# Altium schematic sheet P19_M.2 Key M SSD_Wi-Fi_BT.SchDoc
size 420 x 297 mm
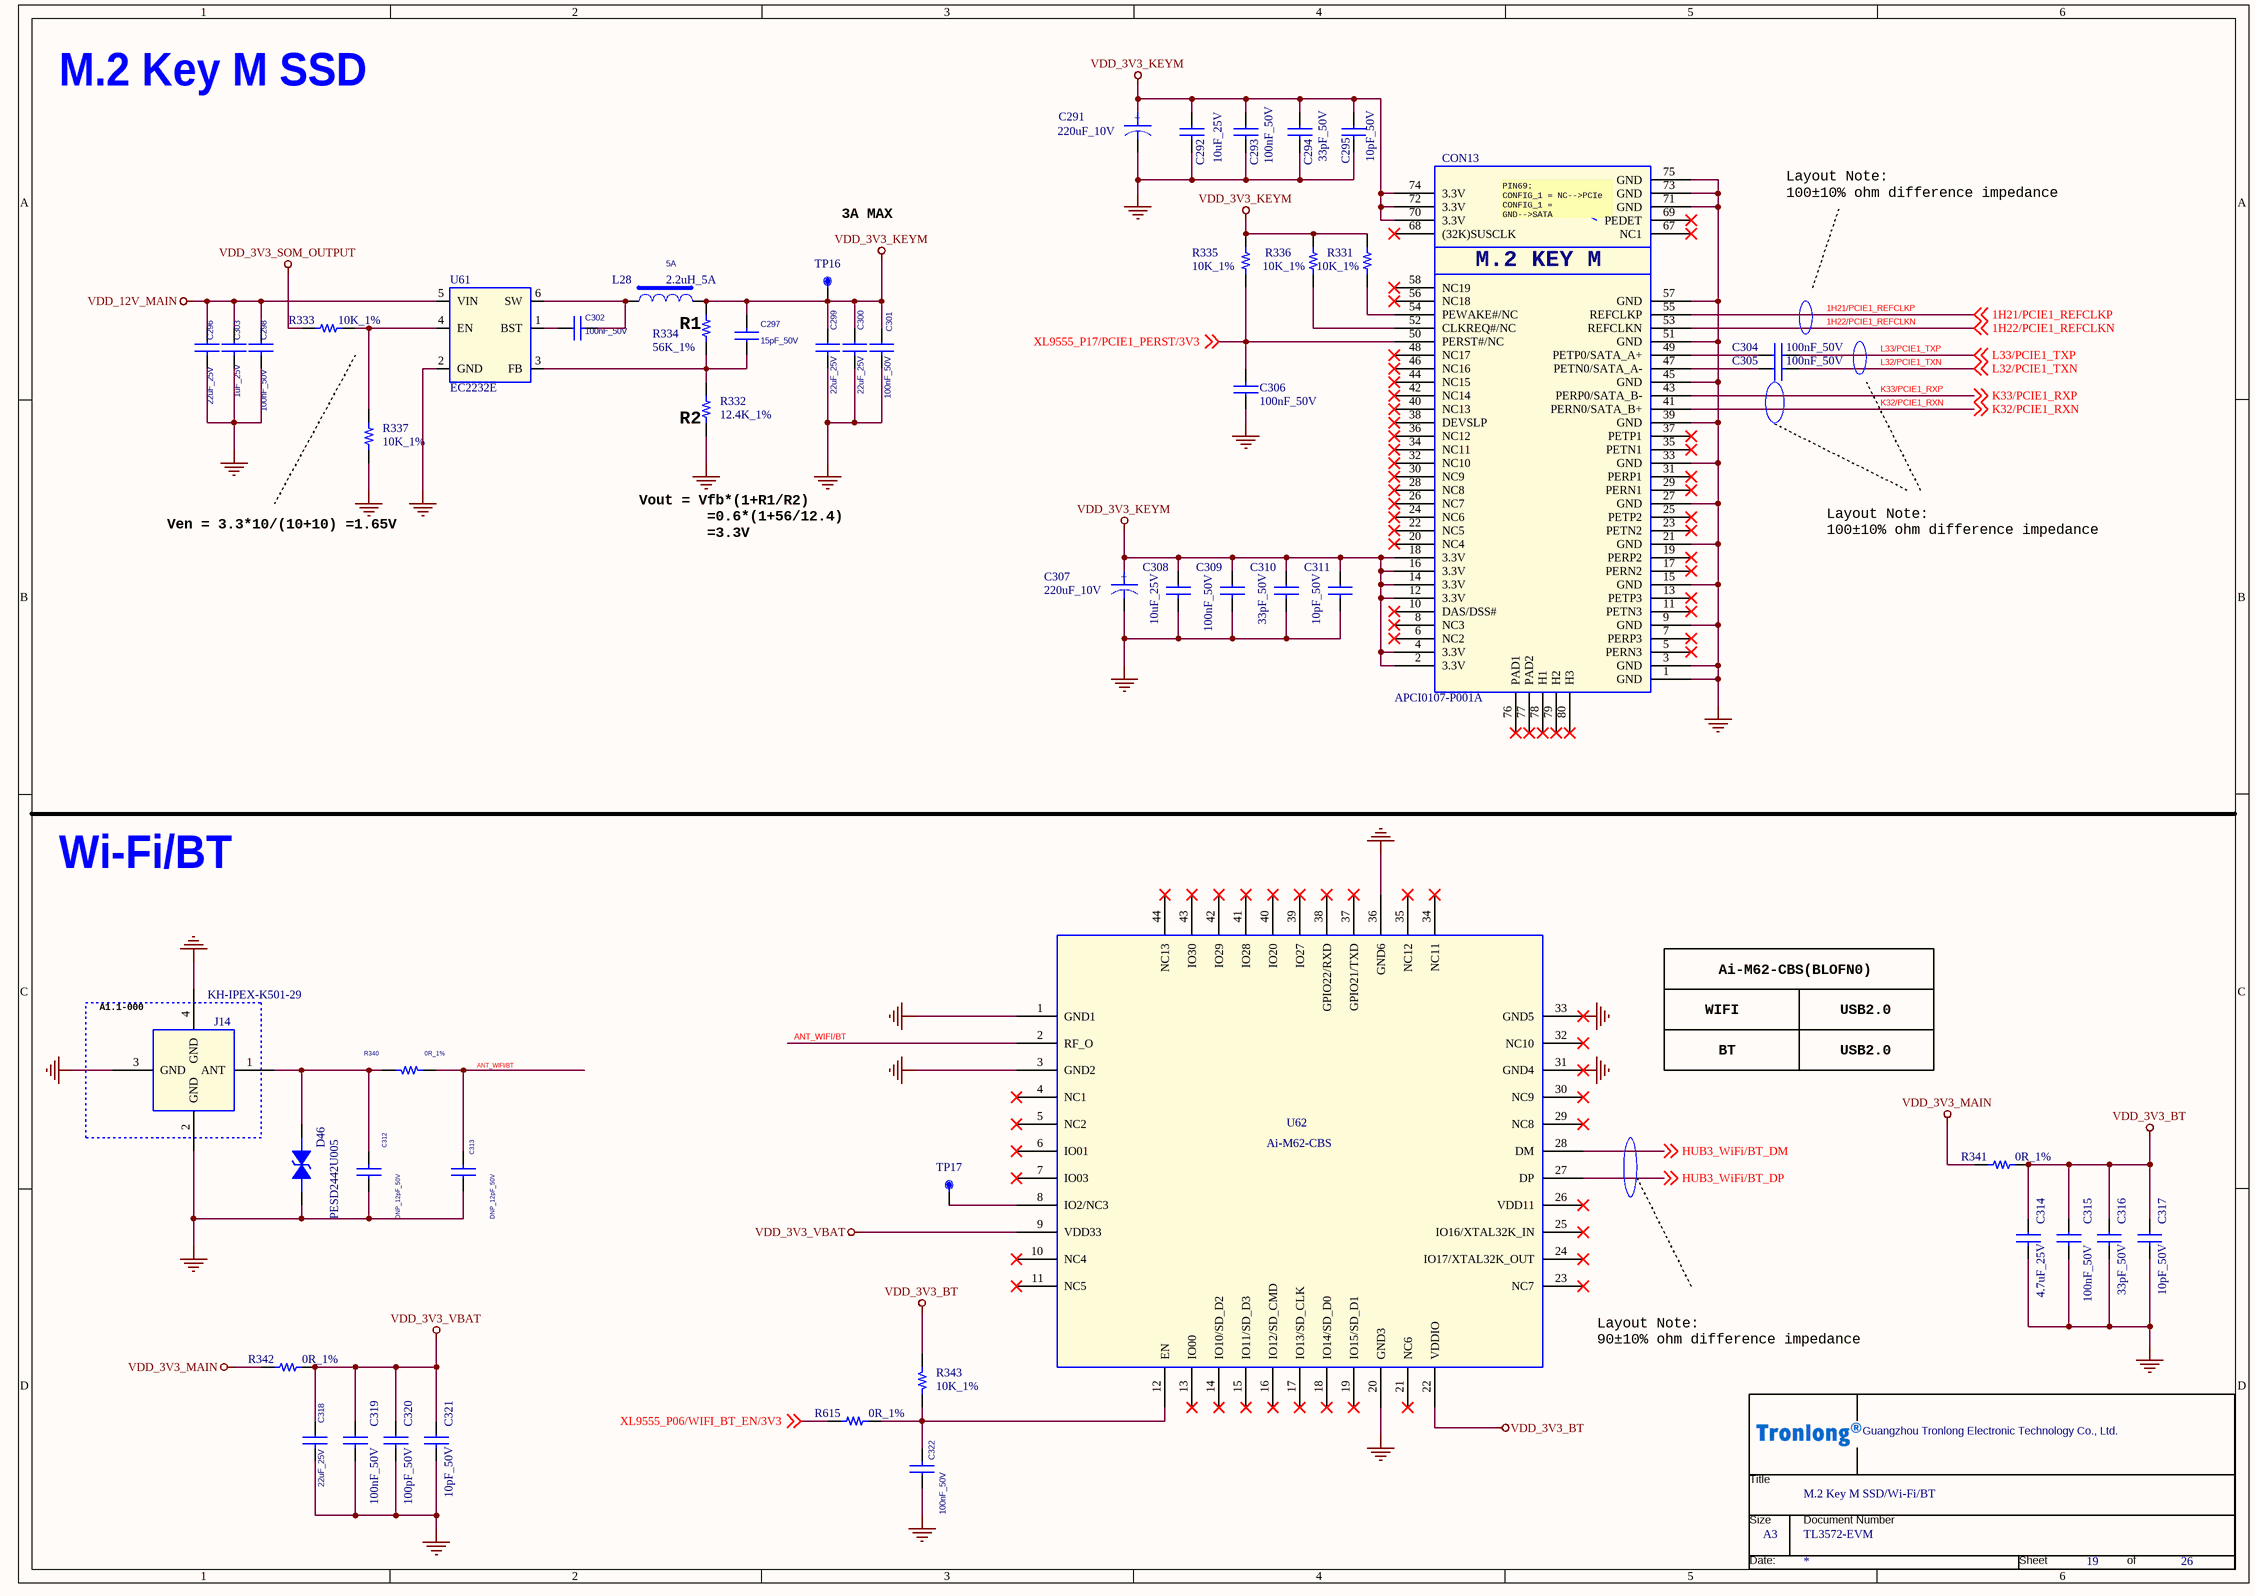
[diagram p0: P19_M.2 Key M SSD_Wi-Fi_BT.SchDoc]

## Parts
*  Doc: TL3572-EVM  Title: M.2 Key M SSD/Wi-Fi/BT  OrgName: Guangzhou Tronlong Electronic Technology Co., Ltd.  Page Size: A3  Page Number: 19  Page Count: 26  (hidden comment: Tronlong_TITTLE_20211115)  (graphical)
C291  220uF_10V  [CAP-CASE-D]
C292  10uF_25V  [C0603]
C293  100nF_50V  [C0402]
C294  33pF_50V  [C0402]
C295  10pF_50V  [C0603]
C296  22uF_25V  [C0805]
C297  15pF_50V  [C0603]
C298  100nF_50V  [C0402]
C299  22uF_25V  [C0805]
C300  22uF_25V  [C0805]
C301  100nF_50V  [C0402]
C302  100nF_50V  [C0402]
C303  1uF_25V  [C0402]
C304  100nF_50V  [C0402]
C305  100nF_50V  [C0402]
C306  100nF_50V  [C0402]
C307  220uF_10V  [CAP-CASE-D]
C308  10uF_25V  [C0603]
C309  100nF_50V  [C0402]
C310  33pF_50V  [C0402]
C311  10pF_50V  [C0603]
C312  DNP_12pF_50V  [C0402]
C313  DNP_12pF_50V  [C0402]
C314  4.7uF_25V  [C0603]
C315  100nF_50V  [C0402]
C316  33pF_50V  [C0402]
C317  10pF_50V  [C0603]
C318  22uF_25V  [C0805]
C319  100nF_50V  [C0402]
C320  100pF_50V  [C0402]
C321  10pF_50V  [C0603]
C322  100nF_50V  [C0402]
CON13  APCI0107-P001A  [CON_SMD_APCI0113-P001A]
D46  PESD2442U005  [ESD_0402]
J14  KH-IPEX-K501-29  [IPEX1]
L28  2.2uH_5A  Current: 5A  [SMD-L4040M-2P]
R331  10K_1%  [R0402]
R332  12.4K_1%  [R0402]
R333  10K_1%  [R0402]
R334  56K_1%  [R0402]
R335  10K_1%  [R0402]
R336  10K_1%  [R0402]
R337  10K_1%  [R0402]
R340  0R_1%  [R0402]
R341  0R_1%  [R0603]
R342  0R_1%  [R0603]
R343  10K_1%  [R0402]
R615  0R_1%  [R0603]
TP16  SMT TP  [TP30]  (value not drawn)
TP17  SMT TP  [TP30]  (value not drawn)
U61  EC2232E  [SOT-23-6L]
U62  Ai-M62-CBS  [FCS950U]

## Blocks framed on the sheet
A1.1-000: J14

## Nets
GND: C291.2 C292.2 C293.2 C294.2 C295.2 C296.2 C298.2 C299.2 C300.2 C301.2 C303.2 C306.1 C307.2 C308.2 C309.2 C310.2 C311.2 C312.1 C313.1 C314.2 C315.2 C316.2 C317.2 C318.2 C319.2 C320.2 C321.2 C322.1 CON13.1(GND) CON13.3(GND) CON13.9(GND) CON13.15(GND) CON13.21(GND) CON13.27(GND) CON13.33(GND) CON13.39(GND) CON13.45(GND) CON13.51(GND) CON13.57(GND) CON13.71(GND) CON13.73(GND) CON13.75(GND) D46.1 J14.2(GND) J14.3(GND) J14.4(GND) R332.1 R337.1 U61.2(GND) U62.1(GND1) U62.3(GND2) U62.20(GND3) U62.31(GND4) U62.33(GND5) U62.36(GND6)
VDD_3V3_BT: C314.1 C315.1 C316.1 C317.1 R341.2 R343.2 U62.22(VDDIO)
VDD_3V3_KEYM: C291.1 C292.1 C293.1 C294.1 C295.1 C297.2 C299.1 C300.1 C301.1 C307.1 C308.1 C309.1 C310.1 C311.1 CON13.2(3.3V) CON13.4(3.3V) CON13.12(3.3V) CON13.14(3.3V) CON13.16(3.3V) CON13.18(3.3V) CON13.70(3.3V) CON13.72(3.3V) CON13.74(3.3V) L28.2 R331.1 R334.2 R335.1 R336.1 TP16.1
VDD_3V3_MAIN: R341.1 R342.1
VDD_3V3_SOM_OUTPUT: R333.2
VDD_3V3_VBAT: C318.1 C319.1 C320.1 C321.1 R342.2 U62.9(VDD33)
VDD_12V_MAIN: C296.1 C298.1 C303.1 U61.5(VIN)
1H21/PCIE1_REFCLKP: CON13.55(REFCLKP) ; off-sheet 1H21/PCIE1_REFCLKP
1H22/PCIE1_REFCLKN: CON13.53(REFCLKN) ; off-sheet 1H22/PCIE1_REFCLKN
ANT_WIFI/BT: C313.2 R340.1 U62.2(RF_O)
HUB3_WiFi/BT_DM: U62.28(DM) ; off-sheet HUB3_WiFi/BT_DM
HUB3_WiFi/BT_DP: U62.27(DP) ; off-sheet HUB3_WiFi/BT_DP
K32/PCIE1_RXN: CON13.41(PERN0/SATA_B+) ; off-sheet K32/PCIE1_RXN
K33/PCIE1_RXP: CON13.43(PERP0/SATA_B-) ; off-sheet K33/PCIE1_RXP
L32/PCIE1_TXN: C305.2 ; off-sheet L32/PCIE1_TXN
L33/PCIE1_TXP: C304.2 ; off-sheet L33/PCIE1_TXP
XL9555_P06/WIFI_BT_EN/3V3: R615.1 ; off-sheet XL9555_P06/WIFI_BT_EN/3V3
XL9555_P17/PCIE1_PERST/3V3: C306.2 CON13.50(PERST#/NC) R335.2 ; off-sheet XL9555_P17/PCIE1_PERST/3V3
NetC297_1: C297.1 R332.2 R334.1 U61.3(FB)
NetC302_1: C302.1 U61.1(BST)
NetC302_2: C302.2 L28.1 U61.6(SW)
NetC304_1: C304.1 CON13.49(PETP0/SATA_A+)
NetC305_1: C305.1 CON13.47(PETN0/SATA_A-)
NetC312_2: C312.2 D46.2 J14.1(ANT) R340.2
NetC322_2: C322.2 R343.1 R615.2 U62.12(EN)
NetCON13_52: CON13.52(CLKREQ#/NC) R336.2
NetCON13_54: CON13.54(PEWAKE#/NC) R331.2
NetR333_1: R333.1 R337.2 U61.4(EN)
NetTP17_1: TP17.1 U62.8(IO2/NC3)

Not connected (* = marked no-connect by the designer): CON13 5(PERN3)* 6(NC2)* 7(PERP3)* 8(NC3)* 10(DAS/DSS#)* 11(PETN3)* 13(PETP3)* 17(PERN2)* 19(PERP2)* 20(NC4)* 22(NC5)* 23(PETN2)* 24(NC6)* 25(PETP2)* 26(NC7)* 28(NC8)* 29(PERN1)* 30(NC9)* 31(PERP1)* 32(NC10)* 34(NC11)* 35(PETN1)* 36(NC12)* 37(PETP1)* 38(DEVSLP)* 40(NC13)* 42(NC14)* 44(NC15)* 46(NC16)* 48(NC17)* 56(NC18)* 58(NC19)* 67(NC1)* 68((32K)SUSCLK)* 69(PEDET)* 76(PAD1)* 77(PAD2)* 78(H1)* 79(H2)* 80(H3)*; U62 4(NC1)* 5(NC2)* 6(IO01)* 7(IO03)* 10(NC4)* 11(NC5)* 13(IO00)* 14(IO10/SD_D2)* 15(IO11/SD_D3)* 16(IO12/SD_CMD)* 17(IO13/SD_CLK)* 18(IO14/SD_D0)* 19(IO15/SD_D1)* 21(NC6)* 23(NC7)* 24(IO17/XTAL32K_OUT)* 25(IO16/XTAL32K_IN)* 26(VDD11)* 29(NC8)* 30(NC9)* 32(NC10)* 34(NC11)* 35(NC12)* 37(GPIO21/TXD)* 38(GPIO22/RXD)* 39(IO27)* 40(IO20)* 41(IO28)* 42(IO29)* 43(IO30)* 44(NC13)*

## Notes on the sheet
- M.2 Key M SSD
- Layout Note:
  100±10% ohm difference impedance
- 3A MAX
- R1
- (near R332) R2
- Ven = 3.3*10/(10+10) =1.65V
- Vout = Vfb*(1+R1/R2)
  =0.6*(1+56/12.4)
  =3.3V
- Wi-Fi/BT
- Ai-M62-CBS(BLOFN0)
- WIFI
- BT
- USB2.0
- Layout Note:
  90±10% ohm difference impedance
- (in symbol CAP POL_Dup1) +
- (in symbol M_2.2 KEY M) PIN69: / CONFIG_1 = NC-->PCIe / CONFIG_1 = / GND-->SATA; M.2 KEY M
- (in symbol Tronlong_TITTLE_20211115) Title; Size; Document Number; Date:; Sheet; of

## Library data of the parts
* = Tronlong_TITTLE_20211115: RevCode: A?; Page Create Date: March  8, 1995; Page Modify Date: *
C291 = CAP POL_Dup1: D型钽电容,220uF,10%,10V; Manufacturer: 湖南湘怡中元科技有限公司（XIANGYEE）; Manufacturer PartNumber: CA45-D010K227T; Manufacturer Character: 中国大陆; Eco-Label: ROHS; ERP Number: 005.0001.0001.00571; Operation Temperature（℃）: -55~+125(Ta); As-Welded: /; PCB Footprint: CAP-CASE-D; Temperature: -55~125℃; Part Status: 优选
C292 = CAP NP_Dup2: 贴片陶瓷电容,10uF,20%,25V,X5R; Manufacturer Character: 中国大陆; Manufacturer PartNumber: 0603X106M250NT; Manufacturer: 广东风华高新科技股份有限公司（FH）; As-Welded: /; Operation Temperature（℃）: -55~+85(Ta); room: 6; ERP Number: 005.0001.0001.00527; Eco-Label: ROHS; PCB Footprint: C0603; Part Status: 优选; Temperature: -55~125℃
C293 C302 = CAP NP_Dup2: 贴片陶瓷电容,100nF,10%,50V,X7R; Manufacturer: 广东风华高新科技股份有限公司（FH）; Manufacturer PartNumber: 0402B104K500NT; Manufacturer Character: 中国大陆; As-Welded: /; Operation Temperature（℃）: -55~+125(Ta); ERP Number: 005.0001.0001.00681; Eco-Label: ROHS; PCB Footprint: C0402; Part Status: 试用; Temperature: -55~125℃
C294 = CAP NP_Dup2: 贴片陶瓷电容,33pF,5%,50V,COG; Manufacturer Character: 中国大陆; Manufacturer: 广东风华高新科技股份有限公司（FH）; Manufacturer PartNumber: 0402CG330J500NT; Eco-Label: ROHS; ERP Number: 005.0001.0001.00658; Operation Temperature（℃）: -55~+125(Ta); As-Welded: /; PCB Footprint: C0402; Temperature: -55~125℃; Part Status: 试用
C295 C317 = CAP NP_Dup2: CL10C100JB8NNNC,CC0603JRNPO9BN100,CC0603JRNP09BN100; Manufacturer: 广州创龙; Manufacturer PartNumber: 10pF,5%,C0603,50V,（X7R,X5R,COG,NPO或X7S）; Eco-Label: ROHS; ERP Number: 005.0001.0022.00118; Operation Temperature（℃）: -40~+85(Ta); As-Welded: /; PCB Footprint: C0603; Manufacturer Character: -; Temperature: -55~125℃; Part Status: -
C296 C299 C300 = CAP NP_Dup2: 贴片陶瓷电容,22uF,20%,25V,X5R; Manufacturer Character: 中国大陆; Manufacturer PartNumber: 0805X226M250NT; Manufacturer: 广东风华高新科技股份有限公司（FH）; Eco-Label: ROHS; ERP Number: 005.0001.0001.00524; Operation Temperature（℃）: -55~+85(Ta); As-Welded: /; PCB Footprint: C0805; Part Status: 优选; Temperature: -55~125℃
C297 = CAP NP_Dup2: CL10C150JB8NNNC,CC0603JRNPO9BN150; Manufacturer PartNumber: 15pF,5%,C0603,50V,（X7R,X5R,COG,NPO或X7S）; Manufacturer: 广州创龙; Eco-Label: ROHS; ERP Number: 005.0001.0022.00126; Operation Temperature（℃）: -40~+85(Ta); As-Welded: /; PCB Footprint: C0603; Part Status: -; Temperature: -55~125℃; Manufacturer Character: -
C298 C322 = CAP NP_Dup2: 贴片陶瓷电容,100nF,10%,50V,X7R; Manufacturer PartNumber: 0402B104K500NT; Manufacturer: 广东风华高新科技股份有限公司（FH）; Manufacturer Character: 中国大陆; Eco-Label: ROHS; ERP Number: 005.0001.0001.00681; Operation Temperature（℃）: -55~+125(Ta); As-Welded: /; PCB Footprint: C0402; Part Status: 试用; Temperature: -55~125℃
C301 C309 = CAP NP_Dup2: 贴片陶瓷电容,100nF,10%,50V,X7R; Manufacturer PartNumber: 0402B104K500NT; Manufacturer: 广东风华高新科技股份有限公司（FH）; Manufacturer Character: 中国大陆; As-Welded: /; Operation Temperature（℃）: -55~+125(Ta); ERP Number: 005.0001.0001.00681; Eco-Label: ROHS; PCB Footprint: C0402; Temperature: -55~125℃; Part Status: 试用
C303 = CAP NP_Dup2: 贴片陶瓷电容,1uF,10%,25V,X5R; Manufacturer Character: 中国大陆; Manufacturer: 广东风华高新科技股份有限公司（FH）; Manufacturer PartNumber: 0402X105K250NT; Eco-Label: ROHS; ERP Number: 005.0001.0001.00640; Operation Temperature（℃）: -55~+85(Ta); As-Welded: /; PCB Footprint: C0402; Part Status: 试用
C304 C305 = CAP NP_Dup2: 贴片陶瓷电容,100nF,10%,50V,X7R; Manufacturer PartNumber: 0402B104K500NT; Manufacturer Character: 中国大陆; Manufacturer: 广东风华高新科技股份有限公司（FH）; As-Welded: /; Operation Temperature（℃）: -55~+125(Ta); ERP Number: 005.0001.0001.00681; Eco-Label: ROHS; PCB Footprint: C0402; Voltage: 50V; Height: 0.55MM; Part Status: 试用
C306 = CAP NP_Dup2: 贴片陶瓷电容,100nF,10%,50V,X7R; Manufacturer Character: 中国大陆; Manufacturer PartNumber: 0402B104K500NT; Manufacturer: 广东风华高新科技股份有限公司（FH）; Eco-Label: ROHS; ERP Number: 005.0001.0001.00681; Operation Temperature（℃）: -55~+125(Ta); room: USB HUB; As-Welded: /; PCB Footprint: C0402; Part Status: 试用
C307 = CAP POL_Dup1: D型钽电容,220uF,10%,10V; Manufacturer PartNumber: CA45-D010K227T; Manufacturer: 湖南湘怡中元科技有限公司（XIANGYEE）; Manufacturer Character: 中国大陆; Eco-Label: ROHS; ERP Number: 005.0001.0001.00571; Operation Temperature（℃）: -55~+125(Ta); As-Welded: /; PCB Footprint: CAP-CASE-D; Temperature: -55~125℃; Part Status: 优选
C308 = CAP NP_Dup2: 贴片陶瓷电容,10uF,20%,25V,X5R; Manufacturer PartNumber: 0603X106M250NT; Manufacturer: 广东风华高新科技股份有限公司（FH）; Manufacturer Character: 中国大陆; As-Welded: /; room: 6; Operation Temperature（℃）: -55~+85(Ta); ERP Number: 005.0001.0001.00527; Eco-Label: ROHS; PCB Footprint: C0603; Part Status: 优选; Temperature: -55~125℃
C310 = CAP NP_Dup2: 贴片陶瓷电容,33pF,5%,50V,COG; Manufacturer Character: 中国大陆; Manufacturer PartNumber: 0402CG330J500NT; Manufacturer: 广东风华高新科技股份有限公司（FH）; Eco-Label: ROHS; ERP Number: 005.0001.0001.00658; Operation Temperature（℃）: -55~+125(Ta); As-Welded: /; PCB Footprint: C0402; Temperature: -55~125℃; Part Status: 试用
C311 = CAP NP_Dup2: CL10C100JB8NNNC,CC0603JRNPO9BN100,CC0603JRNP09BN100; Manufacturer PartNumber: 10pF,5%,C0603,50V,（X7R,X5R,COG,NPO或X7S）; Manufacturer: 广州创龙; Eco-Label: ROHS; ERP Number: 005.0001.0022.00118; Operation Temperature（℃）: -40~+85(Ta); As-Welded: /; PCB Footprint: C0603; Manufacturer Character: -; Temperature: -55~125℃; Part Status: -
C312 C313 = CAP NP_Dup2: CL05C120JB5NNNC,CC0402JRNPO9BN120; Manufacturer: 广州创龙; Manufacturer PartNumber: 12pF,5%,C0402,50V,（X7R,X5R,COG,NPO或X7S）; As-Welded: DNP; Operation Temperature（℃）: -40~+85(Ta); ERP Number: 005.0001.0022.00034; Eco-Label: ROHS; PCB Footprint: C0402; Manufacturer Character: -; Temperature: -55~125℃; Part Status: -
C314 = CAP NP_Dup3: 贴片陶瓷电容,4.7uF,10%,25V,X5R; Manufacturer Character: 中国大陆; Manufacturer PartNumber: 0603X475K250NT; Manufacturer: 广东风华高新科技股份有限公司（FH）; Eco-Label: ROHS; ERP Number: 005.0001.0001.00566; As-Welded: /; Operation Temperature（℃）: -55~+85(Ta); PCB Footprint: C0603; Part Status: 优选
C315 = CAP NP_Dup3: 贴片陶瓷电容,100nF,10%,50V,X7R; Manufacturer Character: 中国大陆; Manufacturer PartNumber: 0402B104K500NT; Manufacturer: 广东风华高新科技股份有限公司（FH）; Eco-Label: ROHS; ERP Number: 005.0001.0001.00681; Operation Temperature（℃）: -55~+125(Ta); As-Welded: /; PCB Footprint: C0402; Part Status: 试用
C316 = CAP NP_Dup2: 贴片陶瓷电容,33pF,5%,50V,COG; Manufacturer: 广东风华高新科技股份有限公司（FH）; Manufacturer PartNumber: 0402CG330J500NT; Manufacturer Character: 中国大陆; Eco-Label: ROHS; ERP Number: 005.0001.0001.00658; Operation Temperature（℃）: -55~+125(Ta); As-Welded: /; PCB Footprint: C0402; Temperature: -55~125℃; Part Status: 试用
C318 = CAP NP_Dup2: 贴片陶瓷电容,22uF,20%,25V,X5R; Manufacturer: 广东风华高新科技股份有限公司（FH）; Manufacturer PartNumber: 0805X226M250NT; Manufacturer Character: 中国大陆; Eco-Label: ROHS; ERP Number: 005.0001.0001.00524; Operation Temperature（℃）: -55~+85(Ta); As-Welded: /; PCB Footprint: C0805; Temperature: -55~125℃; Part Status: 优选
C319 = CAP NP_Dup3: 贴片陶瓷电容,100nF,10%,50V,X7R; Manufacturer: 广东风华高新科技股份有限公司（FH）; Manufacturer PartNumber: 0402B104K500NT; Manufacturer Character: 中国大陆; As-Welded: /; Operation Temperature（℃）: -55~+125(Ta); ERP Number: 005.0001.0001.00681; Eco-Label: ROHS; PCB Footprint: C0402; Part Status: 试用
C320 = CAP NP_Dup3: 贴片陶瓷电容,100pF,5%,50V,COG; Manufacturer PartNumber: 0402CG101J500NT; Manufacturer PN: C1005C0G1H101K050BA; Manufacturer: 广东风华高新科技股份有限公司（FH）; Manufacturer Character: 中国大陆; Tolerance: 10%; Dielectric: C0G; Priority: A; Operation Temperature（℃）: -55~+125(Ta); As-Welded: /; ERP Number: 005.0001.0001.00580; Eco-Label: EXEMPTION; PCB Footprint: C0402; Created by: JJJ; Voltage: 50V; Part Type: C0402; RK PN: C1005C0G1H101K050BA; Part Status: 优选
C321 = CAP NP_Dup2: CL10C100JB8NNNC,CC0603JRNPO9BN100,CC0603JRNP09BN100; Manufacturer PartNumber: 10pF,5%,C0603,50V,（X7R,X5R,COG,NPO或X7S）; Manufacturer: 广州创龙; As-Welded: /; Operation Temperature（℃）: -40~+85(Ta); ERP Number: 005.0001.0022.00118; Eco-Label: ROHS; PCB Footprint: C0603; Manufacturer Character: -; Temperature: -55~125℃; Part Status: -
CON13 = M_2.2 KEY M: （M.2）金手指连接器，KEY M,0.5mm,H=4.2mm; Manufacturer: 深圳市连欣科技有限公司; Manufacturer Character: 中国大陆; Operation Temperature（℃）: /; ERP Number: 005.0001.0003.00544; Eco-Label: ROHS; PCB Footprint: CON_SMD_APCI0113-P001A; Part Status: 优选; As-Welded: /; Manufacturer PartNumber: APCI0107-P001A
D46 = DIODE-TRIG: ESD二极管,VRWM=24V,VBR=300V,一组,双向,8KV,15KV; Manufacturer: 上海雷卯电子科技有限公司（Leiditech）; Manufacturer Character: 中国大陆; As-Welded: /; Eco-Label: ROHS; ERP Number: 005.0001.0017.00056; Operation Temperature（℃）: -40~+90(Tj); PCB Footprint: ESD_0402; Part Status: 优选; Temperature: -55~125℃; Manufacturer PartNumber: PESD2442U005
J14 = IPEX4: IPEX 1代连接器; Manufacturer: 深圳市金航标电子有限公司(kinghelm); Manufacturer Character: 中国大陆; As-Welded: /; Operation Temperature（℃）: -40~85(Ta); PCB Footprint: IPEX1; Manufacturer PartNumber: KH-IPEX-K501-29
L28 = INDUCTOR: 贴片功率电感,2.2uH,0.048Ω,Isat=7.6A,Irms=5A; Manufacturer: 深圳顺络电子股份有限公司（Sunlord）; Manufacturer PartNumber: WPN4020H2R2MT; Manufacturer Character: 中国大陆; Parameter: L2520，奇力新一体成型电感，最大额定电流3A，内阻65毫欧，20%; Eco-Label: ROHS; ERP Number: 005.0001.0006.00163; Operation Temperature（℃）: -40~+125(Ta); As-Welded: /; PCB Footprint: SMD-L4040M-2P; Part Status: 试用; Temperature: -40~125℃
R331 = Resistor_Dup3: 贴片电阻,10K,±1%,1/16W; Manufacturer Character: 中国大陆; Manufacturer PartNumber: RC-02K1002FT; Manufacturer: 广东风华高新科技股份有限公司（FH）; CLASS: DISCRETE; As-Welded: /; room: USB HUB; Operation Temperature（℃）: -55~+125(Ta); ERP Number: 005.0001.0002.01326; Eco-Label: ROHS; PCB Footprint: R0402; Part Status: 优选
R332 = Resistor_Dup3: 0402WGF1242TCE; Manufacturer: 广州创龙; Manufacturer PartNumber: 12.4K,±1%,R0402,≥1/16W; CLASS: DISCRETE; As-Welded: /; Operation Temperature（℃）: -40~+85(Ta); ERP Number: 005.0001.0023.00040; Eco-Label: ROHS; PCB Footprint: R0402; Temperature: -55~155℃; Manufacturer Character: -; Part Status: -
R333 = Resistor_Dup3: 贴片电阻,10K,±1%,1/16W; Manufacturer: 广东风华高新科技股份有限公司（FH）; Manufacturer PartNumber: RC-02K1002FT; Manufacturer Character: 中国大陆; CLASS: DISCRETE; Eco-Label: ROHS; ERP Number: 005.0001.0002.01326; Operation Temperature（℃）: -55~+125(Ta); As-Welded: /; PCB Footprint: R0402; Part Status: 优选; Temperature: –55~155℃
R334 = Resistor_Dup3: RC0402FR-0756KL，0402WGF5602TCE; Manufacturer: 广州创龙; Manufacturer PartNumber: 56K,±1%,R0402,≥1/16W; CLASS: DISCRETE; As-Welded: /; Operation Temperature（℃）: -40~+85(Ta); ERP Number: 005.0001.0023.00207; Eco-Label: ROHS; PCB Footprint: R0402; Temperature: -55~155℃; Manufacturer Character: -; Part Status: -
R335 = Resistor_Dup3: 贴片电阻,10K,±1%,1/16W; Manufacturer: 广东风华高新科技股份有限公司（FH）; Manufacturer Character: 中国大陆; Manufacturer PartNumber: RC-02K1002FT; CLASS: DISCRETE; Eco-Label: ROHS; ERP Number: 005.0001.0002.01326; As-Welded: /; room: USB HUB; Operation Temperature（℃）: -55~+125(Ta); PCB Footprint: R0402; Part Status: 优选
R336 = Resistor_Dup3: 贴片电阻,10K,±1%,1/16W; Manufacturer: 广东风华高新科技股份有限公司（FH）; Manufacturer Character: 中国大陆; Manufacturer PartNumber: RC-02K1002FT; CLASS: DISCRETE; Eco-Label: ROHS; ERP Number: 005.0001.0002.01326; room: USB HUB; Operation Temperature（℃）: -55~+125(Ta); As-Welded: /; PCB Footprint: R0402; Part Status: 优选
R337 = Resistor_Dup3: 贴片电阻,10K,±1%,1/16W; Manufacturer Character: 中国大陆; Manufacturer PartNumber: RC-02K1002FT; Manufacturer: 广东风华高新科技股份有限公司（FH）; CLASS: DISCRETE; Eco-Label: ROHS; ERP Number: 005.0001.0002.01326; Operation Temperature（℃）: -55~+125(Ta); As-Welded: /; PCB Footprint: R0402; Part Status: 优选; Temperature: -55~155℃
R340 = Resistor_Dup3: 贴片电阻,0R,±1%,1/16W; Manufacturer PartNumber: RC-02000FT; Manufacturer: 广东风华高新科技股份有限公司（FH）; Manufacturer Character: 中国大陆; CLASS: DISCRETE; ERP Number: 005.0001.0002.00938; As-Welded: /; Operation Temperature（℃）: -55~+155(Ta); Eco-Label: ROHS; Part Status: 优选; PCB Footprint: R0402
R341 R615 = Resistor_Dup3: 贴片电阻,0R,±1%,1/10W; Manufacturer Character: 中国大陆; Manufacturer PartNumber: RS-03000FT; Manufacturer: 广东风华高新科技股份有限公司（FH）; CLASS: DISCRETE; Eco-Label: ROHS; ERP Number: 005.0001.0002.00956; Operation Temperature（℃）: -55~+155(Ta); room: RS232; As-Welded: /; PCB Footprint: R0603; Part Status: 优选
R342 = Resistor_Dup3: 贴片电阻,0R,±1%,1/10W; Manufacturer: 广东风华高新科技股份有限公司（FH）; Manufacturer PartNumber: RS-03000FT; Manufacturer Character: 中国大陆; CLASS: DISCRETE; As-Welded: /; room: RS232; Operation Temperature（℃）: -55~+155(Ta); ERP Number: 005.0001.0002.00956; Eco-Label: ROHS; PCB Footprint: R0603; Part Status: 优选
R343 = Resistor_Dup3: 贴片电阻,10K,±1%,1/16W; Manufacturer: 广东风华高新科技股份有限公司（FH）; Manufacturer Character: 中国大陆; Manufacturer PartNumber: RC-02K1002FT; CLASS: DISCRETE; Eco-Label: ROHS; ERP Number: 005.0001.0002.01326; As-Welded: /; Operation Temperature（℃）: -55~+125(Ta); PCB Footprint: R0402; Part Status: 优选
TP16 TP17 = TP-S40: /; Manufacturer Character: 中国大陆; Characteristic: Test point,diameter=1.0mm; As-Welded: DNP; PCB Footprint: TP30; Operation Temperature（℃）: /; Manufacturer: /; Manufacturer PartNumber: /
U61 = WD1304E30: DC/DC,Buck,Vin:4.5V~17V,Vout:0.6V~6V,3A,1路; Manufacturer Character: 中国大陆; Manufacturer: 上海芯强微电子股份有限公司（Ecranic）; As-Welded: /; Operation Temperature（℃）: -40~+85(Ta); ERP Number: 005.0001.0004.00889; Eco-Label: ROHS; PCB Footprint: SOT-23-6L; Manufacturer PartNumber: EC2232E; Temperature: -40~85℃; Part Status: 试用
U62 = FCS950U_4: 工业级WIFI & BT 二合一模块选型（USB通信）; Part Description: MODULE WIFI5 BT5 LCC-44 H2.6mm RO; Manufacturer: QUECTEL; Geometry.Height: 2.6mm; ERP Number: 005.0003.0007.00179; Eco-Label: ROHS; As-Welded: /; Operation Temperature（℃）: -45~+85℃; PCB Footprint: FCS950U; Manufacturer Character: -; Manufacturer PartNumber: Ai-M62-CBS; Part Status: 测评